# Altium project 主板513.PrjPCB
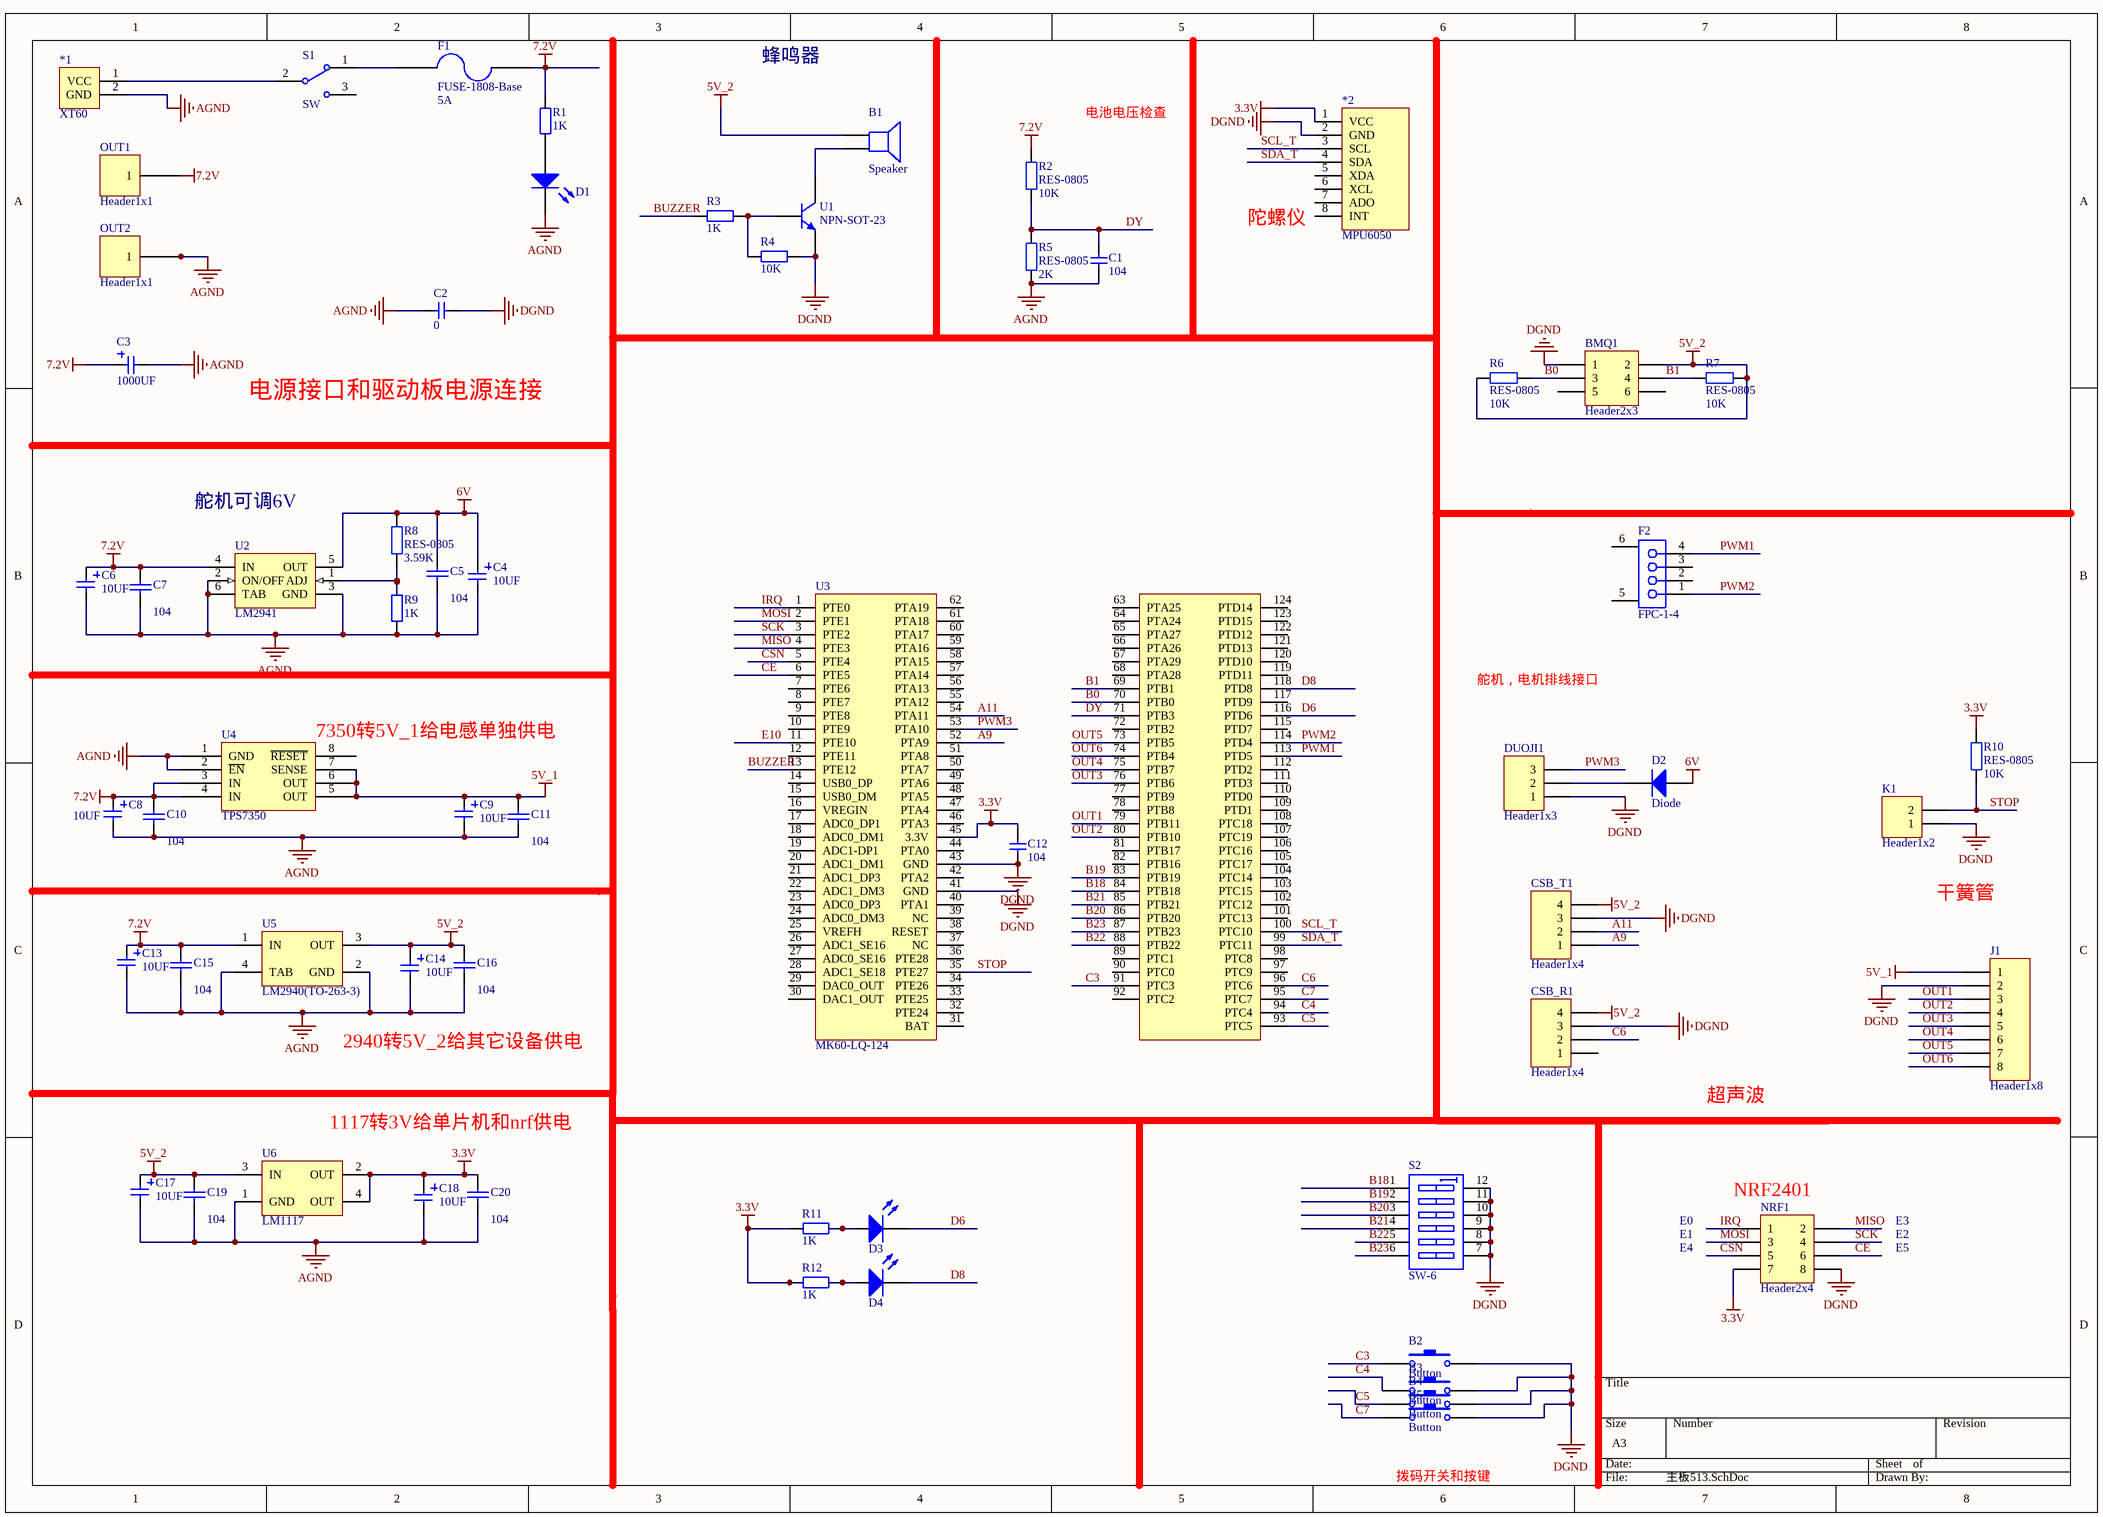
[diagram p0: 主板513.SchDoc]
1 sheet, 62 parts. Net scope: global (net labels, ports and power ports of the same name join across sheets).
Board file: 主板513.PcbDoc

## Sheet 主板513.SchDoc
size A3

### Parts
*1  XT60  [XT60]
*2  MPU6050  [MPU6050]
B1  Speaker  [Beep]
B2  Button  [Button-SMT]
B3  Button  [Button-SMT]
B4  Button  [Button-SMT]
B5  Button  [Button-SMT]
BMQ1  Header2x3  [HEADER2X3]
C1  CAP_0805  [C0805]  (value not drawn)
C2  CAP_0805  [C0805]  (value not drawn)
C3  CAP_1000UF_DIP  [CAP_DIP_8×14]  (value not drawn)
C4  CAP_6032  [CAP_6032_C]  (value not drawn)
C5  (no value)  [CAP-0805]
C6  CAP_6032  [CAP_6032_C]  (value not drawn)
C7  (no value)  [CAP-0805]
C8  CAP_6032  [CAP_6032_C]  (value not drawn)
C9  CAP_6032  [CAP_6032_C]  (value not drawn)
C10  (no value)  [CAP-0805]
C11  (no value)  [CAP-0805]
C12  CAP_0805  [C0805]  (value not drawn)
C13  CAP_6032  [CAP_6032_C]  (value not drawn)
C14  CAP_6032  [CAP_6032_C]  (value not drawn)
C15  (no value)  [CAP-0805]
C16  (no value)  [CAP-0805]
C17  CAP_6032  [CAP_6032_C]  (value not drawn)
C18  CAP_6032  [CAP_6032_C]  (value not drawn)
C19  (no value)  [CAP-0805]
C20  (no value)  [CAP-0805]
CSB_R1  Header1x4  [HEADER1X4]
CSB_T1  Header1x4  [HEADER1X4]
D1  LED_0805_R  [LED_0805_R]  (value not drawn)
D2  Diode  [DIODE]
D3  LED_0805_R  [LED_0805_R]  (value not drawn)
D4  LED_0805_R  [LED_0805_R]  (value not drawn)
DUOJI1  Header1x3  [HEADER1X3]
F1  FUSE-1808-Base  [Fuse1808_Base]
F2  FPC-1-4  [FPC-1-4]
J1  Header1x8  [HEADER1X8]
K1  Header1x2  [HEADER1X2]
NRF1  Header2x4  [HEADER2X4]
OUT1  Header1x1  [HEADER1X1]
OUT2  Header1x1  [HEADER1X1]
R1  RES  [R0805]  (value not drawn)
R2  RES-0805  [RES-0805]
R3  RES  [R0805]  (value not drawn)
R4  RES  [R0805]  (value not drawn)
R5  RES-0805  [RES-0805]
R6  RES-0805  [RES-0805]
R7  RES-0805  [RES-0805]
R8  RES-0805  [RES-0805]
R9  RES  [R0805]  (value not drawn)
R10  RES-0805  [RES-0805]
R11  RES  [R0805]  (value not drawn)
R12  RES  [R0805]  (value not drawn)
S1  SW  [SW-B]
S2  SW-6  [SW-SMT-12]
U1  NPN-SOT-23  [SOT-23]
U2  LM2941  [TO-263-5S]
U3  MK60-LQ-124  [MK60-LQ-144]
U4  TPS7350  [SOP-8]
U5  LM2940(TO-263-3)  [TO-263-3]
U6  LM1117  [SOT-223]

### Nets
3.3V: *2.1(VCC) C12.2 C18.1 C20.2 NRF1.7 R10.2 R11.1 R12.1 U3.45(3.3V) U6.2(OUT) U6.4(OUT)
5V_1: C9.1 C11.2 J1.1 U4.5(OUT) U4.6(OUT) U4.7(SENSE)
5V_2: B1.1 BMQ1.2 C14.1 C16.2 C17.1 C19.2 CSB_R1.4 CSB_T1.4 R6.1 R7.2 U5.3(OUT) U6.3(IN)
6V: C4.1 C5.2 D2.1(A) R8.1 U2.5(OUT)
7.2V: C3.1 C6.1 C7.2 C8.1 C10.2 C13.1 C15.2 F1.2 OUT1.1 R1.1 R2.2 U2.4(IN) U4.3(IN) U4.4(IN) U5.1(IN)
AGND: *1.2(GND) C1.1 C2.2 C3.2 C4.2 C5.1 C6.2 C7.1 C8.2 C9.2 C10.1 C11.1 C13.2 C14.2 C15.1 C16.1 C17.2 C18.2 C19.1 C20.1 D1.2(K) OUT2.1 R5.1 R9.1 U2.2(ON/OFF) U2.3(GND) U2.6(TAB) U4.1(GND) U4.2(~{EN}) U5.2(GND) U5.4(TAB) U6.1(GND)
DGND: *2.2(GND) B2.2 B3.2 B4.2 B5.2 BMQ1.1 C2.1 C12.1 CSB_R1.3 CSB_T1.3 DUOJI1.1 J1.2 K1.1 NRF1.8 R4.2 S2.7(B6) S2.8(B5) S2.9(B4) S2.10(B3) S2.11(B2) S2.12(B1) U1.1(E) U3.41(GND) U3.43(GND)
A9: CSB_T1.1 U3.52(PTA9)
A11: CSB_T1.2 U3.54(PTA11)
B0: BMQ1.3 R6.2 U3.70(PTB0)
B1: BMQ1.4 R7.1 U3.69(PTB1)
B18: S2.1(A1) U3.84(PTB18)
B19: S2.2(A2) U3.83(PTB19)
B20: S2.3(A3) U3.86(PTB20)
B21: S2.4(A4) U3.85(PTB21)
B22: S2.5(A5) U3.88(PTB22)
B23: S2.6(A6) U3.87(PTB23)
BUZZER: R3.1 U3.13(PTE12)
C3: B2.1 U3.91(PTC3)
C4: B3.1 U3.94(PTC4)
C5: B4.1 U3.93(PTC5)
C6: CSB_R1.2 U3.96(PTC6)
C7: B5.1 U3.95(PTC7)
CE: NRF1.6 U3.6(PTE5)
CSN: NRF1.5 U3.5(PTE4)
D6: D3.2(K) U3.116(PTD6)
D8: D4.2(K) U3.118(PTD8)
DY: C1.2 R2.1 R5.2 U3.71(PTB3)
E10: U3.11(PTE10)
IRQ: NRF1.1 U3.1(PTE0)
MISO: NRF1.2 U3.4(PTE3)
MOSI: NRF1.3 U3.2(PTE1)
OUT1: J1.3 U3.79(PTB11)
OUT2: J1.4 U3.80(PTB10)
OUT3: J1.5 U3.76(PTB6)
OUT4: J1.6 U3.75(PTB7)
OUT5: J1.7 U3.73(PTB5)
OUT6: J1.8 U3.74(PTB4)
PWM1: F2.4 U3.113(PTD5)
PWM2: F2.1 U3.114(PTD4)
PWM3: DUOJI1.3 U3.53(PTA10)
SCK: NRF1.4 U3.3(PTE2)
SCL_T: *2.3(SCL) U3.100(PTC10)
SDA_T: *2.4(SDA) U3.99(PTC11)
STOP: K1.2 R10.1 U3.35(PTE27)
Net*1_1: *1.1(VCC) S1.2
NetB1_2: B1.2 U1.3(C)
NetD1_1: D1.1(A) R1.2
NetD2_2: D2.2(K) DUOJI1.2
NetD3_1: D3.1(A) R11.2
NetD4_1: D4.1(A) R12.2
NetF1_1: F1.1 S1.1
NetR3_2: R3.2 R4.1 U1.2(B)
NetR8_2: R8.2 R9.2 U2.1(ADJ)

Not connected (* = marked no-connect by the designer): *2 5(XDA) 6(XCL) 7(ADO) 8(INT); BMQ1 5 6; CSB_R1 1; F2 2 3 5(MH1) 6(MH2); S1 3; U3 7(PTE6) 8(PTE7) 9(PTE8) 10(PTE9) 12(PTE11) 14(USB0_DP) 15(USB0_DM) 16(VREGIN) 17(ADC0_DP1) 18(ADC0_DM1) 19(ADC1-DP1) 20(ADC1_DM1) 21(ADC1_DP3) 22(ADC1_DM3) 23(ADC0_DP3) 24(ADC0_DM3) 25(VREFH) 26(ADC1_SE16) 27(ADC0_SE16) 28(ADC1_SE18) 29(DAC0_OUT) 30(DAC1_OUT) 31(BAT) 32(PTE24) 33(PTE25) 34(PTE26) 36(PTE28) 37(NC) 38(RESET) 39(NC) 40(PTA1) 42(PTA2) 44(PTA0) 46(PTA3) 47(PTA4) 48(PTA5) 49(PTA6) 50(PTA7) 51(PTA8) 55(PTA12) 56(PTA13) 57(PTA14) 58(PTA15) 59(PTA16) 60(PTA17) 61(PTA18) 62(PTA19) 63(PTA25) 64(PTA24) 65(PTA27) 66(PTA26) 67(PTA29) 68(PTA28) 72(PTB2) 77(PTB9) 78(PTB8) 81(PTB17) 82(PTB16) 89(PTC1) 90(PTC0) 92(PTC2) 97(PTC9) 98(PTC8) 101(PTC13) 102(PTC12) 103(PTC15) 104(PTC14) 105(PTC17) 106(PTC16) 107(PTC19) 108(PTC18) 109(PTD1) 110(PTD0) 111(PTD3) 112(PTD2) 115(PTD7) 117(PTD9) 119(PTD11) 120(PTD10) 121(PTD13) 122(PTD12) 123(PTD15) 124(PTD14); U4 8(~{RESET})

### Notes on the sheet
- 蜂鸣器
- 电池电压检查
- 陀螺仪
- 电源接口和驱动板电源连接
- 舵机可调6V
- 舵机，电机排线接口
- (near U4) 7350转5V_1给电感单独供电
- 干簧管
- 2940转5V_2给其它设备供电
- 1117转3V给单片机和nrf供电
- 超声波
- (near NRF1) NRF2401
- E0
- E1
- E4
- E5
- E2
- E3
- 拨码开关和按键
- (in symbol CAP-0805(2012)) 104
- (in symbol CAP_0805) 104; 0
- (in symbol CAP_1000UF_DIP) 1000UF
- (in symbol CAP_6032) 10UF
- (in symbol FUSE-1808-Base) 5A
- (in symbol RES) 1K; 10K
- (in symbol RES-0805) 10K; 2K; 3.59K

### Library data of the parts
B1 = Speaker: Loudspeaker; Published: 24-Mar-1999; LatestRevisionDate: 17-Jul-2002; LatestRevisionNote: Re-released for DXP Platform.; PackageReference: PIN2; Publisher: Altium Limited
C5 C7 C10 C11 C15 C16 C19 C20 = CAP-0805(2012)
F1 = FUSE-1808-Base: 保险丝
U6 = LM1117_SOT_223